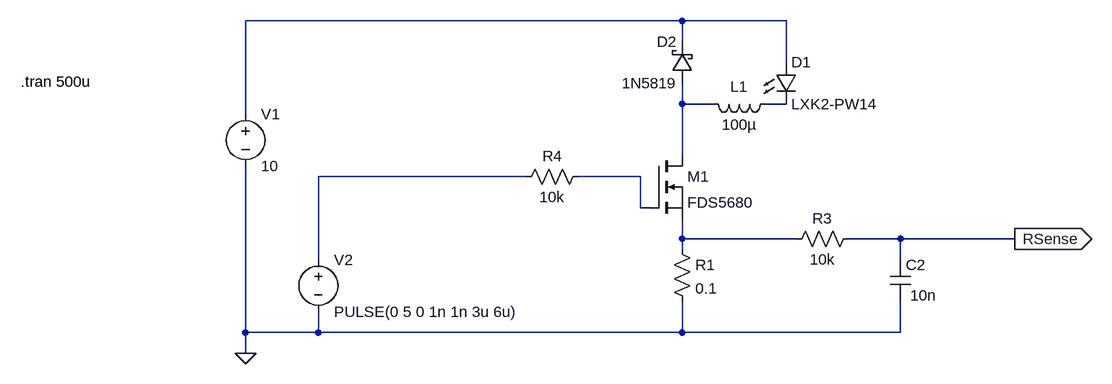
[diagram p0: schematic loochi-v0.3-withouttransistors.asc]
loochi-v0.3-withouttransistors.asc, the LTspice schematic file:
Version 4
SHEET 1 1460 680
WIRE 16 -64 -656 -64
WIRE 176 -64 16 -64
WIRE 16 -32 16 -64
WIRE 176 0 176 -64
WIRE 16 64 16 32
WIRE 64 64 16 64
WIRE 176 64 144 64
WIRE -656 80 -656 -64
WIRE 16 144 16 64
WIRE -224 176 -544 176
WIRE -48 176 -144 176
WIRE -48 224 -48 176
WIRE -32 224 -48 224
WIRE 16 272 16 240
WIRE 192 272 16 272
WIRE 352 272 272 272
WIRE 528 272 352 272
WIRE 16 288 16 272
WIRE -544 304 -544 176
WIRE 352 304 352 272
WIRE -656 416 -656 160
WIRE -544 416 -544 384
WIRE -544 416 -656 416
WIRE 16 416 16 368
WIRE 16 416 -544 416
WIRE 352 416 352 368
WIRE 352 416 16 416
WIRE -656 448 -656 416
FLAG -656 448 0
FLAG 528 272 RSense
IOPIN 528 272 Out
SYMBOL voltage -656 64 R0
WINDOW 123 0 0 Left 2
WINDOW 39 0 0 Left 2
SYMATTR InstName V1
SYMATTR Value 10
SYMBOL nmos -32 144 R0
SYMATTR InstName M1
SYMATTR Value FDS5680
SYMBOL res 0 272 R0
SYMATTR InstName R1
SYMATTR Value 0.1
SYMBOL voltage -544 288 R0
WINDOW 123 0 0 Left 2
WINDOW 39 0 0 Left 2
SYMATTR InstName V2
SYMATTR Value PULSE(0 5 0 1n 1n 3u 6u)
SYMBOL LED 160 0 R0
SYMATTR InstName D1
SYMATTR Value LXK2-PW14
SYMATTR Description Diode
SYMATTR Type diode
SYMBOL ind 160 48 R90
WINDOW 0 5 56 VBottom 2
WINDOW 3 32 56 VTop 2
SYMATTR InstName L1
SYMATTR Value 100µ
SYMBOL schottky 32 32 R180
WINDOW 0 24 64 Left 2
WINDOW 3 24 0 Left 2
SYMATTR InstName D2
SYMATTR Value 1N5819
SYMATTR Description Diode
SYMATTR Type diode
SYMBOL res 288 256 R90
WINDOW 0 0 56 VBottom 2
WINDOW 3 32 56 VTop 2
SYMATTR InstName R3
SYMATTR Value 10k
SYMBOL cap 336 304 R0
WINDOW 3 31 55 Left 2
SYMATTR InstName C2
SYMATTR Value 10n
SYMBOL res -128 160 R90
WINDOW 0 0 56 VBottom 2
WINDOW 3 32 56 VTop 2
SYMATTR InstName R4
SYMATTR Value 10k
TEXT -1002 30 Left 2 !.tran 500u

The netlist it stands for:
* loochi-v0.3-withouttransistors.asc
V1 N001 0 10
M1 N002 N005 N006 N006 FDS5680
R1 N006 0 0.1
V2 N004 0 PULSE(0 5 0 1n 1n 3u 6u)
D1 N001 N003 LXK2-PW14
L1 N003 N002 100µ
D2 N002 N001 1N5819
R3 RSense N006 10k
C2 RSense 0 10n
R4 N005 N004 10k
.model D D
.lib standard.dio
.model NMOS NMOS
.model PMOS PMOS
.lib standard.mos
.tran 500u
.backanno
.end